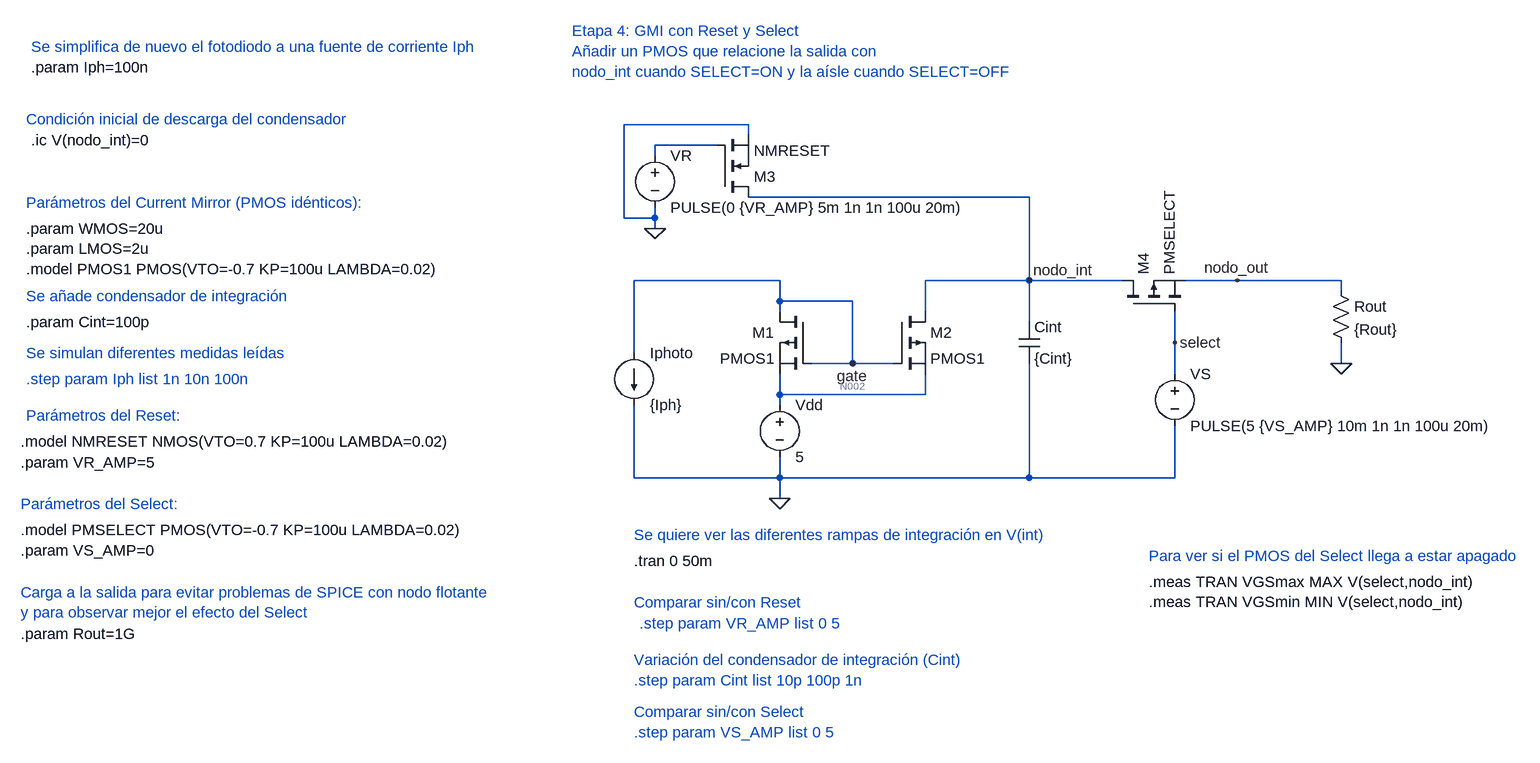
[diagram p0: schematic GMI_Etapa4.asc]
GMI_Etapa4.asc, the LTspice schematic file:
Version 4.1
SHEET 1 1756 1176
WIRE 336 224 144 224
WIRE 336 240 336 224
WIRE 288 256 192 256
WIRE 192 272 192 256
WIRE 768 336 336 336
WIRE 144 368 144 224
WIRE 192 368 192 352
WIRE 192 368 144 368
WIRE 192 384 192 368
WIRE 384 464 160 464
WIRE 768 464 768 336
WIRE 768 464 608 464
WIRE 912 464 768 464
WIRE 1088 464 1008 464
WIRE 1248 464 1088 464
WIRE 1248 480 1248 464
WIRE 384 496 384 464
WIRE 496 496 384 496
WIRE 384 512 384 496
WIRE 608 512 608 464
WIRE 768 528 768 464
WIRE 992 560 992 512
WIRE 160 576 160 464
WIRE 496 592 496 496
WIRE 496 592 432 592
WIRE 560 592 496 592
WIRE 1248 592 1248 560
WIRE 992 608 992 560
WIRE 384 640 384 608
WIRE 608 640 608 608
WIRE 608 640 384 640
WIRE 384 656 384 640
WIRE 160 768 160 656
WIRE 384 768 384 736
WIRE 384 768 160 768
WIRE 768 768 768 592
WIRE 768 768 384 768
WIRE 992 768 992 688
WIRE 992 768 768 768
WIRE 384 800 384 768
FLAG 384 800 0
FLAG 768 464 nodo_int
FLAG 496 592 gate
FLAG 192 384 0
FLAG 1088 464 nodo_out
FLAG 992 560 select
FLAG 1248 592 0
SYMBOL voltage 384 640 R0
WINDOW 123 0 0 Left 0
WINDOW 39 0 0 Left 0
SYMATTR InstName Vdd
SYMATTR Value 5
SYMBOL current 160 576 R0
SYMATTR InstName Iphoto
SYMATTR Value {Iph}
SYMBOL cap 752 528 R0
SYMATTR InstName Cint
SYMATTR Value {Cint}
SYMBOL pmos 560 512 R0
SYMATTR InstName M2
SYMATTR Value PMOS1
SYMATTR SpiceLine L={LMOS} W={WMOS}
SYMBOL pmos 432 512 M0
SYMATTR InstName M1
SYMATTR Value PMOS1
SYMATTR SpiceLine L={LMOS} W={WMOS}
SYMBOL voltage 192 256 R0
SYMATTR InstName VR
SYMATTR Value PULSE(0 {VR_AMP} 5m 1n 1n 100u 20m)
SYMBOL nmos 288 336 M180
SYMATTR InstName M3
SYMATTR Value NMRESET
SYMATTR SpiceLine L={LMOS} W={WMOS}
SYMBOL pmos 912 512 R270
SYMATTR InstName M4
SYMATTR Value PMSELECT
SYMATTR SpiceLine L={LMOS} W={WMOS}
SYMBOL voltage 992 592 R0
SYMATTR InstName VS
SYMATTR Value PULSE(5 {VS_AMP} 10m 1n 1n 100u 20m)
SYMBOL res 1232 464 R0
SYMATTR InstName Rout
SYMATTR Value {Rout}
TEXT 64 80 Left 2 ;Etapa 4: GMI con Reset y Select\nAñadir un PMOS que relacione la salida con \nnodo_int cuando SELECT=ON y la aísle cuando SELECT=OFF
TEXT -776 384 Left 2 !.param WMOS=20u\n.param LMOS=2u\n.model PMOS1 PMOS(VTO=-0.7 KP=100u LAMBDA=0.02)
TEXT -776 616 Left 2 ;.step param Iph list 1n 10n 100n
TEXT -776 344 Left 2 ;Parámetros del Current Mirror (PMOS idénticos):
TEXT -768 104 Left 2 ;Se simplifica de nuevo el fotodiodo a una fuente de corriente Iph
TEXT -768 136 Left 2 !.param Iph=100n
TEXT -776 576 Left 2 ;Se simulan diferentes medidas leídas
TEXT 160 896 Left 2 !.tran 0 50m
TEXT -776 488 Left 2 ;Se añade condensador de integración
TEXT -776 528 Left 2 !.param Cint=100p
TEXT 160 856 Left 2 ;Se quiere ver las diferentes rampas de integración en V(int)
TEXT -768 248 Left 2 !.ic V(nodo_int)=0
TEXT -776 216 Left 2 ;Condición inicial de descarga del condensador
TEXT -776 672 Left 2 ;Parámetros del Reset:
TEXT -784 712 Left 2 !.model NMRESET NMOS(VTO=0.7 KP=100u LAMBDA=0.02)
TEXT -784 744 Left 2 !.param VR_AMP=5
TEXT 160 1048 Left 2 ;Variación del condensador de integración (Cint)
TEXT 160 1080 Left 2 ;.step param Cint list 10p 100p 1n
TEXT 168 992 Left 2 ;.step param VR_AMP list 0 5
TEXT 160 960 Left 2 ;Comparar sin/con Reset
TEXT -784 848 Left 2 !.model PMSELECT PMOS(VTO=-0.7 KP=100u LAMBDA=0.02)
TEXT -784 808 Left 2 ;Parámetros del Select:
TEXT -784 880 Left 2 !.param VS_AMP=0
TEXT 160 1128 Left 2 ;Comparar sin/con Select
TEXT 160 1160 Left 2 ;.step param VS_AMP list 0 5
TEXT -784 944 Left 2 ;Carga a la salida para evitar problemas de SPICE con nodo flotante\ny para observar mejor el efecto del Select
TEXT -784 1008 Left 2 !.param Rout=1G
TEXT 952 928 Left 2 !.meas TRAN VGSmax MAX V(select,nodo_int)\n.meas TRAN VGSmin MIN V(select,nodo_int)
TEXT 952 888 Left 2 ;Para ver si el PMOS del Select llega a estar apagado

The netlist it stands for:
* GMI_Etapa4.asc
Vdd N002 0 5
Iphoto gate 0 {Iph}
Cint nodo_int 0 {Cint}
M2 nodo_int gate N002 N002 PMOS1 L={LMOS} W={WMOS}
M1 gate gate N002 N002 PMOS1 L={LMOS} W={WMOS}
VR N001 0 PULSE(0 {VR_AMP} 5m 1n 1n 100u 20m)
M3 nodo_int N001 0 0 NMRESET L={LMOS} W={WMOS}
M4 nodo_int select nodo_out nodo_out PMSELECT L={LMOS} W={WMOS}
VS select 0 PULSE(5 {VS_AMP} 10m 1n 1n 100u 20m)
Rout nodo_out 0 {Rout}
.model NMOS NMOS
.model PMOS PMOS
.lib standard.mos
* Etapa 4: GMI con Reset y Select
* Añadir un PMOS que relacione la salida con
* nodo_int cuando SELECT=ON y la aísle cuando SELECT=OFF
.param WMOS=20u
.param LMOS=2u
.model PMOS1 PMOS(VTO=-0.7 KP=100u LAMBDA=0.02)
* .step param Iph list 1n 10n 100n
* Parámetros del Current Mirror (PMOS idénticos):
* Se simplifica de nuevo el fotodiodo a una fuente de corriente Iph
.param Iph=100n
* Se simulan diferentes medidas leídas
.tran 0 50m
* Se añade condensador de integración
.param Cint=100p
* Se quiere ver las diferentes rampas de integración en V(int)
.ic V(nodo_int)=0
* Condición inicial de descarga del condensador
* Parámetros del Reset:
.model NMRESET NMOS(VTO=0.7 KP=100u LAMBDA=0.02)
.param VR_AMP=5
* Variación del condensador de integración (Cint)
* .step param Cint list 10p 100p 1n
* .step param VR_AMP list 0 5
* Comparar sin/con Reset
.model PMSELECT PMOS(VTO=-0.7 KP=100u LAMBDA=0.02)
* Parámetros del Select:
.param VS_AMP=0
* Comparar sin/con Select
* .step param VS_AMP list 0 5
* Carga a la salida para evitar problemas de SPICE con nodo flotante
* y para observar mejor el efecto del Select
.param Rout=1G
.meas TRAN VGSmax MAX V(select,nodo_int)
.meas TRAN VGSmin MIN V(select,nodo_int)
* Para ver si el PMOS del Select llega a estar apagado
.backanno
.end

* Results of the author's LTspice run, read from the files saved beside the schematic
* Operating Point, zero values left out:
*   V(gate) = 4.286 V
*   V(n002) = 5 V
*   V(select) = 5 V
*   I(Iphoto) = 100 nA
*   I(Vdd) = -208.5 nA
*   Ib(M2) = 5.01 pA
*   Id(M1) = -100.5 nA
*   Id(M2) = -109 nA
*   Is(M1) = 100.5 nA
*   Is(M2) = 109 nA
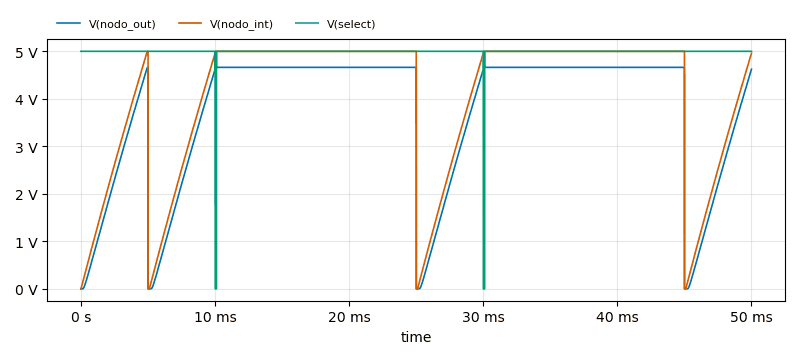
[diagram p1: Transient Analysis of GMI_Etapa4.asc, plotted from the saved traces]
* Transient Analysis, 1 run:
*   V(nodo_out): min 0 V, max 5.001 V, average 3.684 V, rms 3.978 V, last 4.622 V
*   V(nodo_int): min 0 V, max 5.002 V, average 4.005 V, rms 4.287 V, last 4.959 V
*   V(select): min 0 V, max 5 V, average 4.98 V, rms 4.99 V, last 5 V
* From the log:
*   vgsmax: MAX(V(select,nodo_int))=5 FROM 0 TO 0.05
*   vgsmin: MIN(V(select,nodo_int))=-5.00087499619 FROM 0 TO 0.05